# EasyEDA schematic IR LED stick.json

## Sheets
1 Switch: TITLE: Sheet_1; REV: 1.0; Date: 2024-07-03; Sheet: 1/1; Company: Your Company
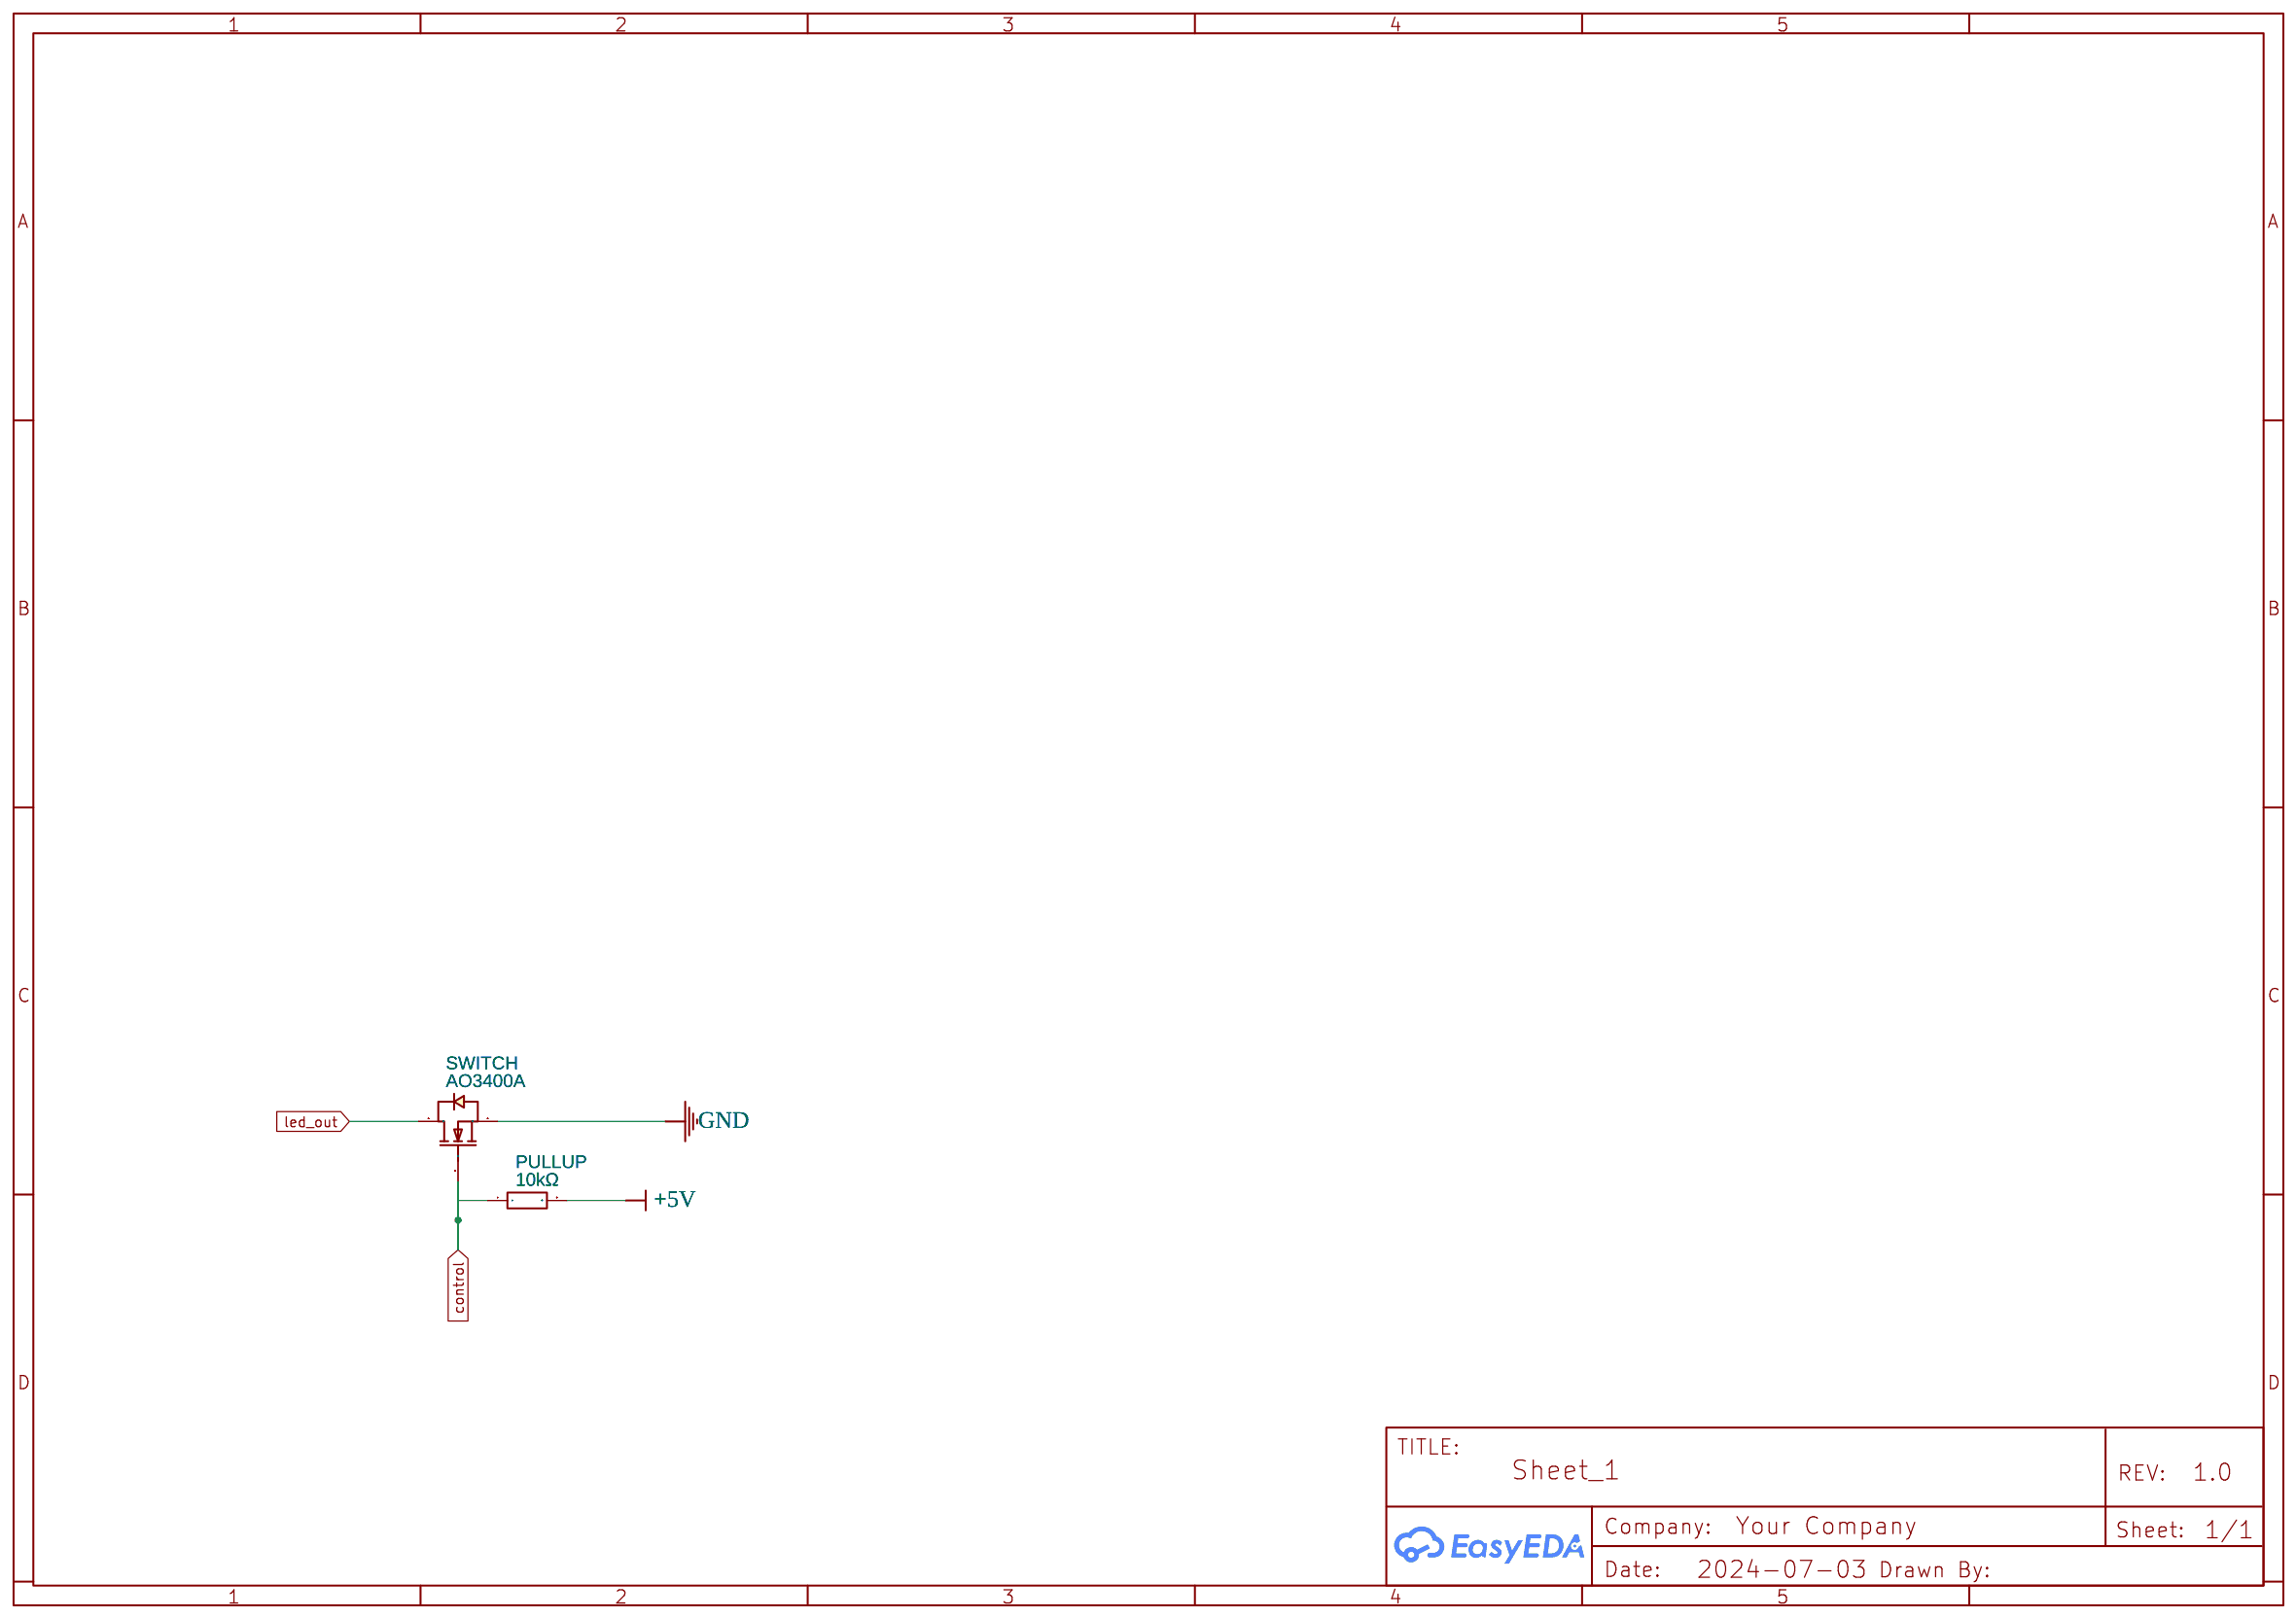
[diagram p0: Switch]
2 LEDs: TITLE: Sheet_2; Date: 2024-07-04
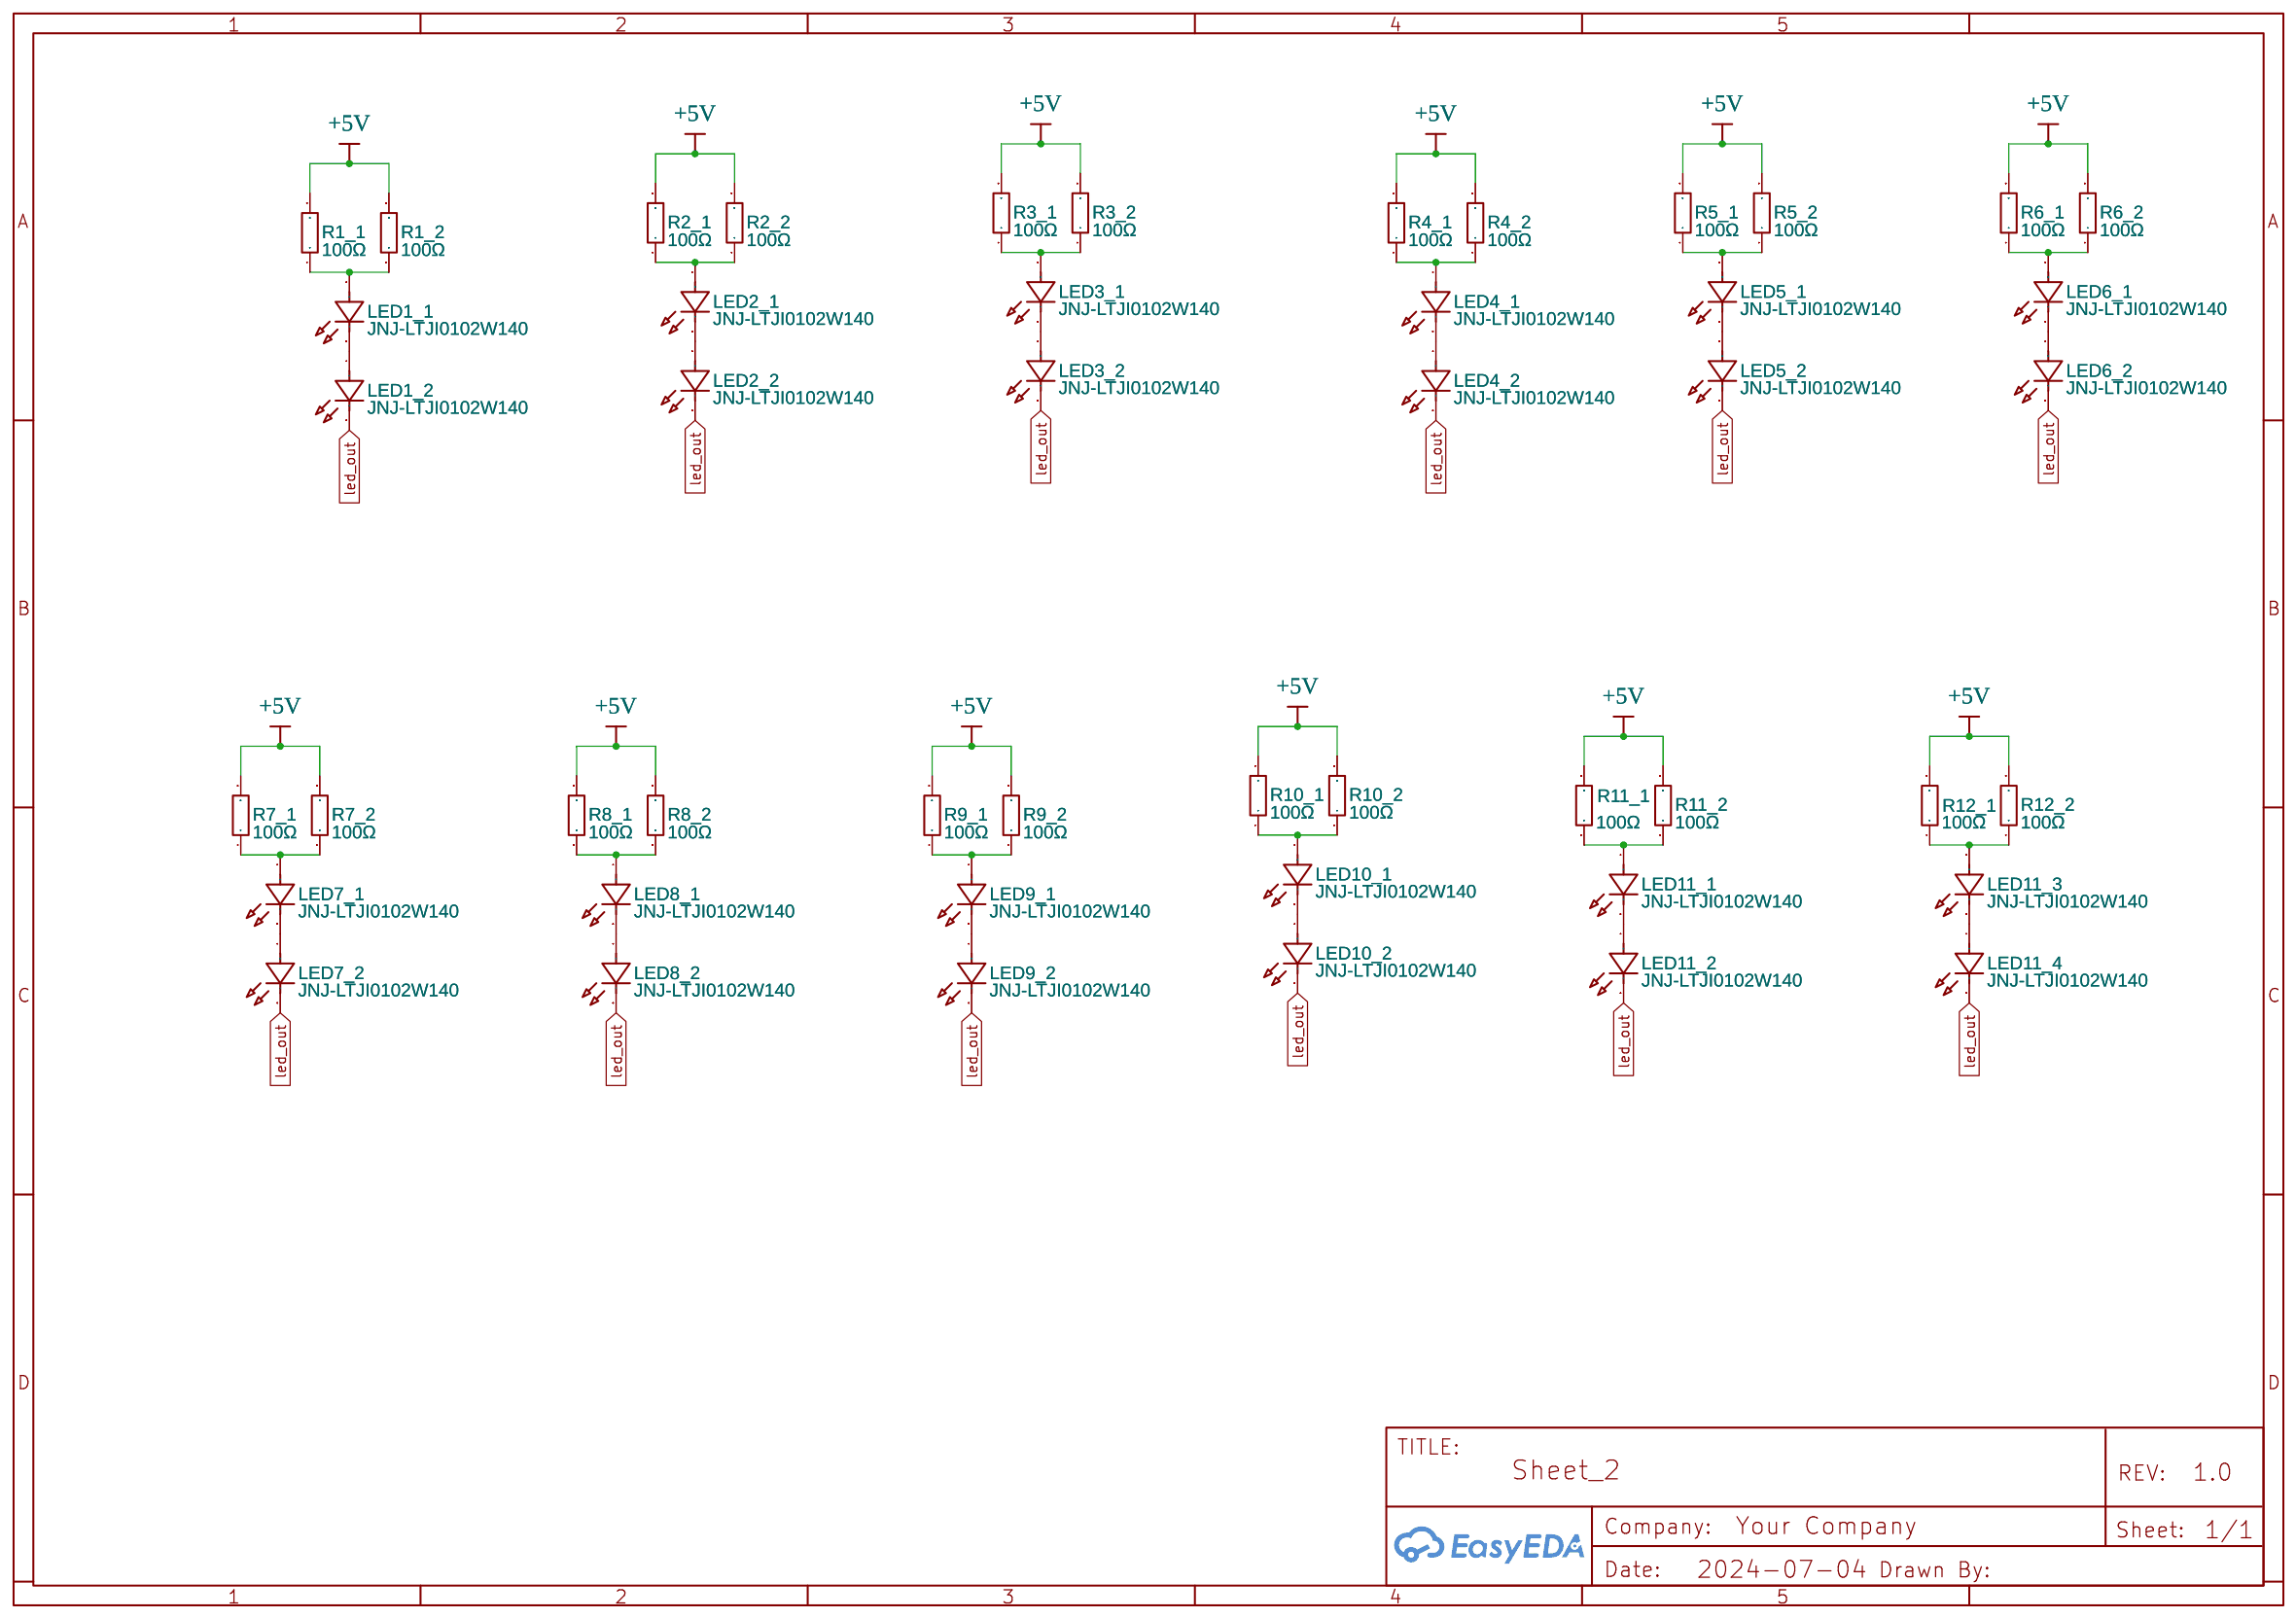
[diagram p1: LEDs]
3 IO: Date: 2024-07-04; Drawn By: davidswygart
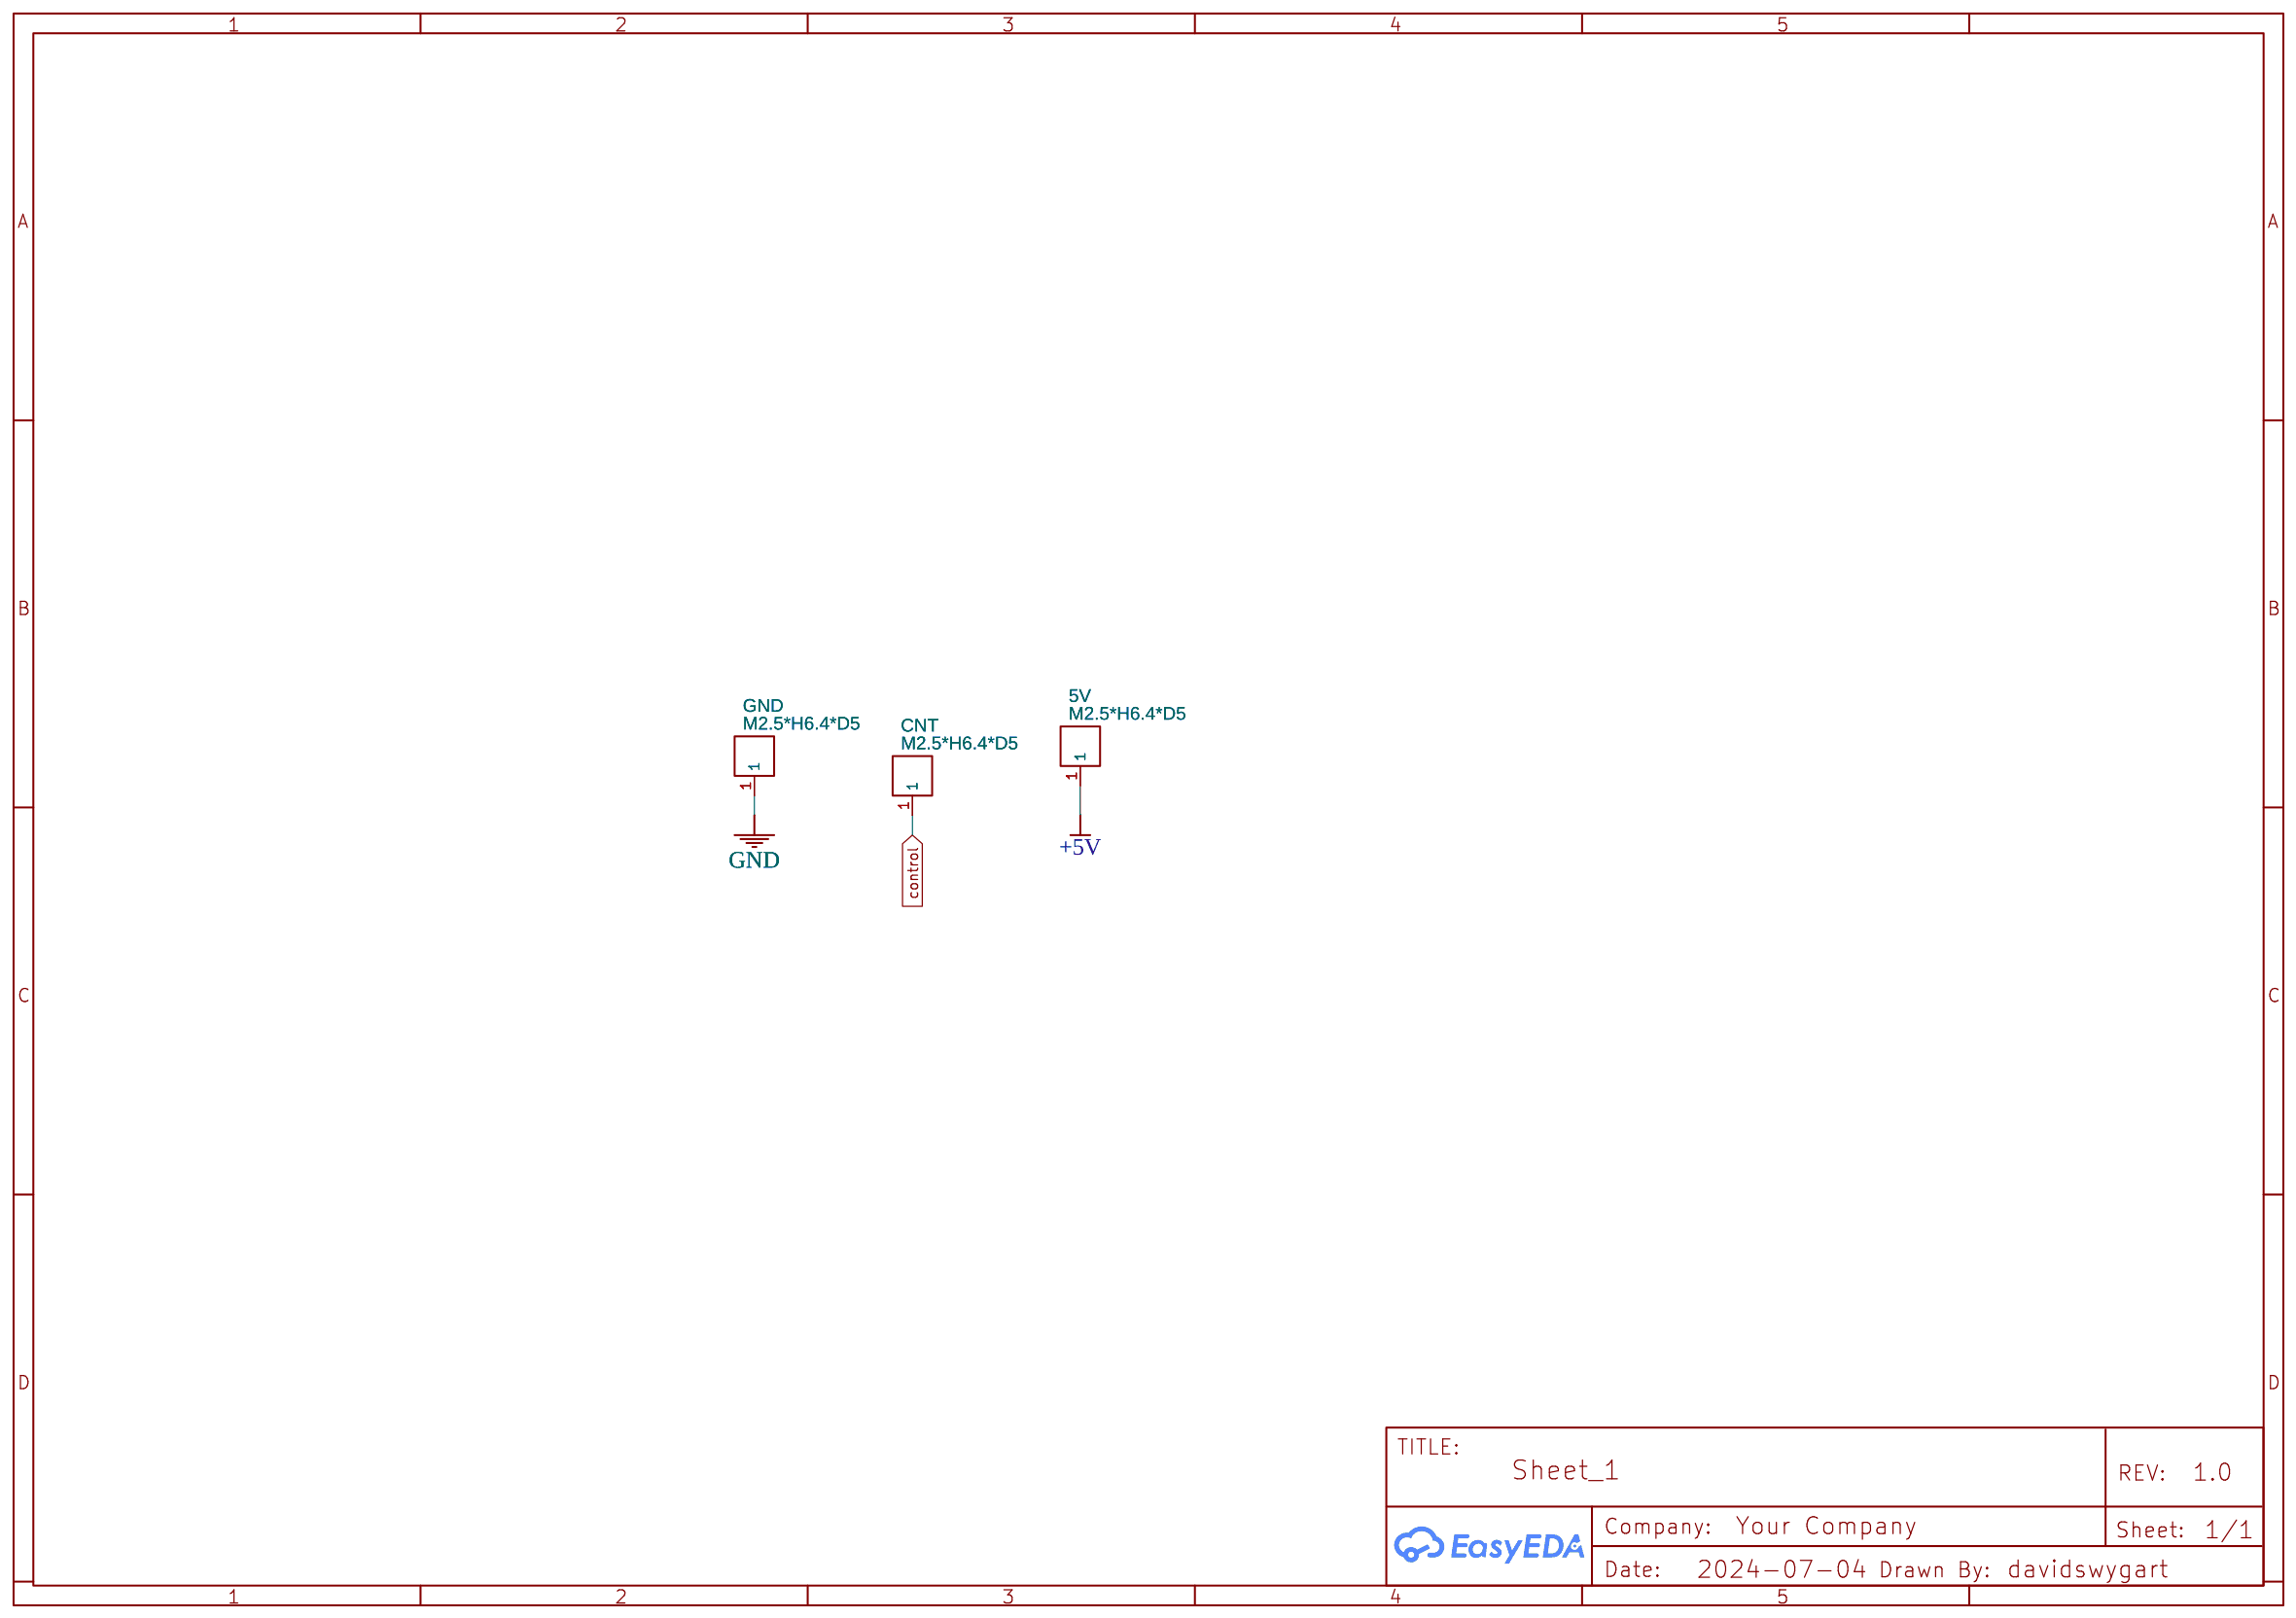
[diagram p2: IO]

## Parts
sheet IO
5V  M2.5*H6.4*D5  [SCREW-SMD_BD5.0-D2.5]
CNT  M2.5*H6.4*D5  [SCREW-SMD_BD5.0-D2.5]
GND  M2.5*H6.4*D5  [SCREW-SMD_BD5.0-D2.5]
sheet LEDs
LED1_1  JNJ-LTJI0102W140  [LED-SMD_L3.5-W2.8-FD_WHITE]
LED1_2  JNJ-LTJI0102W140  [LED-SMD_L3.5-W2.8-FD_WHITE]
LED2_1  JNJ-LTJI0102W140  [LED-SMD_L3.5-W2.8-FD_WHITE]
LED2_2  JNJ-LTJI0102W140  [LED-SMD_L3.5-W2.8-FD_WHITE]
LED3_1  JNJ-LTJI0102W140  [LED-SMD_L3.5-W2.8-FD_WHITE]
LED3_2  JNJ-LTJI0102W140  [LED-SMD_L3.5-W2.8-FD_WHITE]
LED4_1  JNJ-LTJI0102W140  [LED-SMD_L3.5-W2.8-FD_WHITE]
LED4_2  JNJ-LTJI0102W140  [LED-SMD_L3.5-W2.8-FD_WHITE]
LED5_1  JNJ-LTJI0102W140  [LED-SMD_L3.5-W2.8-FD_WHITE]
LED5_2  JNJ-LTJI0102W140  [LED-SMD_L3.5-W2.8-FD_WHITE]
LED6_1  JNJ-LTJI0102W140  [LED-SMD_L3.5-W2.8-FD_WHITE]
LED6_2  JNJ-LTJI0102W140  [LED-SMD_L3.5-W2.8-FD_WHITE]
LED7_1  JNJ-LTJI0102W140  [LED-SMD_L3.5-W2.8-FD_WHITE]
LED7_2  JNJ-LTJI0102W140  [LED-SMD_L3.5-W2.8-FD_WHITE]
LED8_1  JNJ-LTJI0102W140  [LED-SMD_L3.5-W2.8-FD_WHITE]
LED8_2  JNJ-LTJI0102W140  [LED-SMD_L3.5-W2.8-FD_WHITE]
LED9_1  JNJ-LTJI0102W140  [LED-SMD_L3.5-W2.8-FD_WHITE]
LED9_2  JNJ-LTJI0102W140  [LED-SMD_L3.5-W2.8-FD_WHITE]
LED10_1  JNJ-LTJI0102W140  [LED-SMD_L3.5-W2.8-FD_WHITE]
LED10_2  JNJ-LTJI0102W140  [LED-SMD_L3.5-W2.8-FD_WHITE]
LED11_1  JNJ-LTJI0102W140  [LED-SMD_L3.5-W2.8-FD_WHITE]
LED11_2  JNJ-LTJI0102W140  [LED-SMD_L3.5-W2.8-FD_WHITE]
LED11_3  JNJ-LTJI0102W140  [LED-SMD_L3.5-W2.8-FD_WHITE]
LED11_4  JNJ-LTJI0102W140  [LED-SMD_L3.5-W2.8-FD_WHITE]
R1_1  100Ω  [R0805]
R1_2  100Ω  [R0805]
R2_1  100Ω  [R0805]
R2_2  100Ω  [R0805]
R3_1  100Ω  [R0805]
R3_2  100Ω  [R0805]
R4_1  100Ω  [R0805]
R4_2  100Ω  [R0805]
R5_1  100Ω  [R0805]
R5_2  100Ω  [R0805]
R6_1  100Ω  [R0805]
R6_2  100Ω  [R0805]
R7_1  100Ω  [R0805]
R7_2  100Ω  [R0805]
R8_1  100Ω  [R0805]
R8_2  100Ω  [R0805]
R9_1  100Ω  [R0805]
R9_2  100Ω  [R0805]
R10_1  100Ω  [R0805]
R10_2  100Ω  [R0805]
R11_1  100Ω  [R0805]
R11_2  100Ω  [R0805]
R12_1  100Ω  [R0805]
R12_2  100Ω  [R0805]
sheet Switch
PULLUP  10kΩ  [R0603]
SWITCH  AO3400A  [SOT-23-3_L2.9-W1.6-P1.90-LS2.8-BR]

## Library data of the parts
5V CNT GND = M2.5*H6.4*D5: Supplier: LCSC; Supplier Part: C9900109989; Manufacturer: null; Contributor: lcsc; JLCPCB Part Class: Extended Part
LED1_1 LED1_2 LED2_1 LED2_2 LED3_1 LED3_2 LED4_1 LED4_2 LED5_1 LED5_2 LED6_1 LED6_2 LED7_1 LED7_2 LED8_1 LED8_2 LED9_1 LED9_2 LED10_1 LED10_2 LED11_1-LED11_4 = JNJ-LTJI0102W140: Supplier: LCSC; Supplier Part: C7529186; Manufacturer: JNJ OPTOELECTRONICS(强生光电); Contributor: lcsc; JLCPCB Part Class: Extended Part
R1_1 R1_2 R2_1 R2_2 R3_1 R3_2 R4_1 R4_2 R5_1 R5_2 R6_1 R6_2 R7_1 R7_2 R8_1 R8_2 R9_1 R9_2 R10_1 R10_2 R11_1 R11_2 R12_1 R12_2 = 0805W8F1000T5E: Supplier: LCSC; Manufacturer: UNI-ROYAL(厚声); Supplier Part: C17408; JLCPCB Part Class: Basic Part
PULLUP = 0603WAF1002T5E: Supplier: LCSC; Manufacturer: UNI-ROYAL(厚声); Supplier Part: C25804; JLCPCB Part Class: Basic Part
SWITCH = AO3400A: Supplier: LCSC; Manufacturer: AOS; Supplier Part: C20917; JLCPCB Part Class: Basic Part

## Nets
+5V: 5V.1 PULLUP.2 R1_1.2 R1_2.2 R2_1.2 R2_2.2 R3_1.2 R3_2.2 R4_1.2 R4_2.2 R5_1.2 R5_2.2 R6_1.2 R6_2.2 R7_1.2 R7_2.2 R8_1.2 R8_2.2 R9_1.2 R9_2.2 R10_1.2 R10_2.2 R11_1.2 R11_2.2 R12_1.2 R12_2.2
GND: GND.1 SWITCH.2(S)
control: CNT.1 PULLUP.1 SWITCH.1(G)
led_out: LED1_2.2(-) LED2_2.2(-) LED3_2.2(-) LED4_2.2(-) LED5_2.2(-) LED6_2.2(-) LED7_2.2(-) LED8_2.2(-) LED9_2.2(-) LED10_2.2(-) LED11_2.2(-) LED11_4.2(-) SWITCH.3(D)
Net-(LED1_1-1): LED1_1.1(+) R1_1.1 R1_2.1
Net-(LED1_1-2): LED1_1.2(-) LED1_2.1(+)
Net-(LED2_1-1): LED2_1.1(+) R2_1.1 R2_2.1
Net-(LED2_1-2): LED2_1.2(-) LED2_2.1(+)
Net-(LED3_1-1): LED3_1.1(+) R3_1.1 R3_2.1
Net-(LED3_1-2): LED3_1.2(-) LED3_2.1(+)
Net-(LED4_1-1): LED4_1.1(+) R4_1.1 R4_2.1
Net-(LED4_1-2): LED4_1.2(-) LED4_2.1(+)
Net-(LED5_1-1): LED5_1.1(+) R5_1.1 R5_2.1
Net-(LED5_1-2): LED5_1.2(-) LED5_2.1(+)
Net-(LED6_1-1): LED6_1.1(+) R6_1.1 R6_2.1
Net-(LED6_1-2): LED6_1.2(-) LED6_2.1(+)
Net-(LED7_1-1): LED7_1.1(+) R7_1.1 R7_2.1
Net-(LED7_1-2): LED7_1.2(-) LED7_2.1(+)
Net-(LED8_1-1): LED8_1.1(+) R8_1.1 R8_2.1
Net-(LED8_1-2): LED8_1.2(-) LED8_2.1(+)
Net-(LED9_1-1): LED9_1.1(+) R9_1.1 R9_2.1
Net-(LED9_1-2): LED9_1.2(-) LED9_2.1(+)
Net-(LED10_1-1): LED10_1.1(+) R10_1.1 R10_2.1
Net-(LED10_1-2): LED10_1.2(-) LED10_2.1(+)
Net-(LED11_1-1): LED11_1.1(+) R11_1.1 R11_2.1
Net-(LED11_1-2): LED11_1.2(-) LED11_2.1(+)
Net-(LED11_3-1): LED11_3.1(+) R12_1.1 R12_2.1
Net-(LED11_3-2): LED11_3.2(-) LED11_4.1(+)
